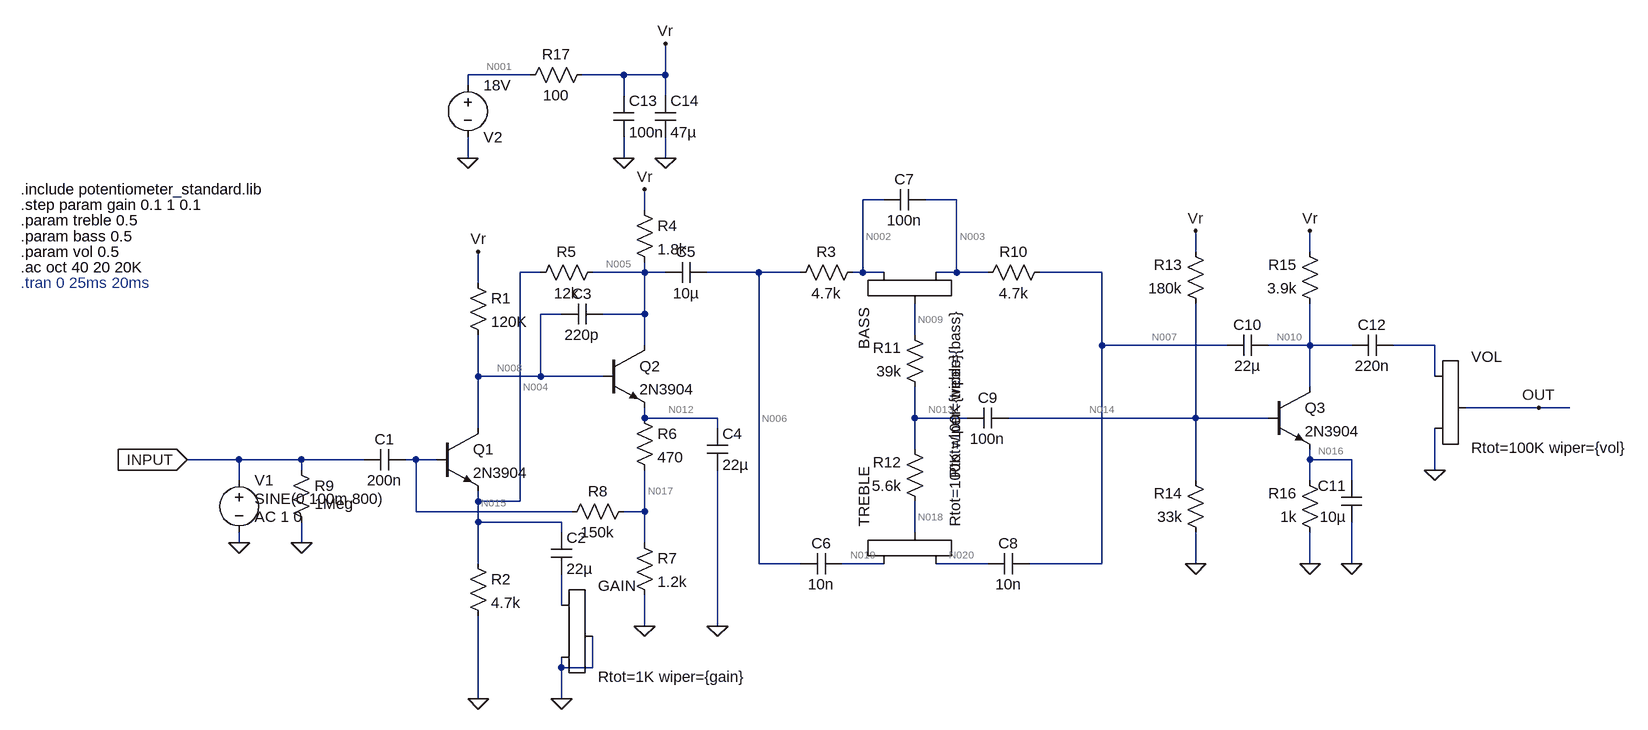
[diagram p0: schematic shining_pig.asc]
shining_pig.asc, the LTspice schematic file:
Version 4
SHEET 1 2004 680
WIRE 288 -400 192 -400
WIRE 432 -400 368 -400
WIRE 496 -400 496 -448
WIRE 496 -400 432 -400
WIRE 192 -384 192 -400
WIRE 432 -368 432 -400
WIRE 496 -368 496 -400
WIRE 192 -272 192 -304
WIRE 432 -272 432 -304
WIRE 496 -272 496 -304
WIRE 832 -208 800 -208
WIRE 944 -208 896 -208
WIRE 464 -192 464 -224
WIRE 1312 -128 1312 -160
WIRE 1488 -128 1488 -160
WIRE 304 -96 272 -96
WIRE 464 -96 464 -112
WIRE 464 -96 384 -96
WIRE 496 -96 464 -96
WIRE 640 -96 560 -96
WIRE 704 -96 640 -96
WIRE 800 -96 800 -208
WIRE 800 -96 784 -96
WIRE 832 -96 800 -96
WIRE 944 -96 944 -208
WIRE 944 -96 912 -96
WIRE 992 -96 944 -96
WIRE 1168 -96 1072 -96
WIRE 208 -80 208 -128
WIRE 336 -32 304 -32
WIRE 464 -32 464 -96
WIRE 464 -32 400 -32
WIRE 880 0 880 -48
WIRE 464 16 464 -32
WIRE 1168 16 1168 -96
WIRE 1360 16 1168 16
WIRE 1488 16 1488 -48
WIRE 1488 16 1424 16
WIRE 1552 16 1488 16
WIRE 1680 16 1616 16
WIRE 208 64 208 0
WIRE 304 64 304 -32
WIRE 304 64 208 64
WIRE 400 64 304 64
WIRE 1680 64 1680 16
WIRE 1488 80 1488 16
WIRE 1840 112 1728 112
WIRE 1888 112 1840 112
WIRE 464 128 464 112
WIRE 576 128 464 128
WIRE 880 128 880 80
WIRE 960 128 880 128
WIRE 1312 128 1312 -48
WIRE 1312 128 1024 128
WIRE 1424 128 1312 128
WIRE 208 144 208 64
WIRE 576 144 576 128
WIRE 880 176 880 128
WIRE -160 192 -240 192
WIRE -64 192 -160 192
WIRE 32 192 -64 192
WIRE 112 192 96 192
WIRE 144 192 112 192
WIRE 1488 192 1488 176
WIRE 1552 192 1488 192
WIRE -64 208 -64 192
WIRE 1680 208 1680 144
WIRE -160 224 -160 192
WIRE 1312 224 1312 128
WIRE 1488 224 1488 192
WIRE 1552 224 1552 192
WIRE 208 256 208 240
WIRE 272 256 272 -96
WIRE 272 256 208 256
WIRE 112 272 112 192
WIRE 352 272 112 272
WIRE 464 272 464 208
WIRE 464 272 432 272
WIRE 208 288 208 256
WIRE 336 288 208 288
WIRE 336 304 336 288
WIRE 880 304 880 256
WIRE -160 320 -160 304
WIRE -64 320 -64 288
WIRE 464 320 464 272
WIRE 208 352 208 288
WIRE 640 352 640 -96
WIRE 704 352 640 352
WIRE 832 352 768 352
WIRE 992 352 912 352
WIRE 1168 352 1168 16
WIRE 1168 352 1056 352
WIRE 1312 352 1312 304
WIRE 1488 352 1488 304
WIRE 1552 352 1552 288
WIRE 336 416 336 368
WIRE 464 448 464 400
WIRE 576 448 576 208
WIRE 336 512 336 496
WIRE 384 512 384 464
WIRE 384 512 336 512
WIRE 208 560 208 432
WIRE 336 560 336 512
FLAG -240 192 INPUT
IOPIN -240 192 In
FLAG -160 320 0
FLAG 208 560 0
FLAG 336 560 0
FLAG 464 448 0
FLAG 576 448 0
FLAG -64 320 0
FLAG 1312 352 0
FLAG 1488 352 0
FLAG 1552 352 0
FLAG 1680 208 0
FLAG 1840 112 OUT
FLAG 432 -272 0
FLAG 496 -272 0
FLAG 192 -272 0
FLAG 496 -448 Vr
FLAG 208 -128 Vr
FLAG 464 -224 Vr
FLAG 1312 -160 Vr
FLAG 1488 -160 Vr
SYMBOL cap 96 176 R90
WINDOW 0 0 32 VBottom 2
WINDOW 3 32 32 VTop 2
SYMATTR InstName C1
SYMATTR Value 200n
SYMBOL voltage -160 208 R0
WINDOW 3 24 44 Left 2
WINDOW 123 24 72 Left 2
WINDOW 39 0 0 Left 2
SYMATTR Value SINE(0 100m 800)
SYMATTR Value2 AC 1 0
SYMATTR InstName V1
SYMBOL npn 144 144 R0
SYMATTR InstName Q1
SYMATTR Value 2N3904
SYMBOL voltage 192 -400 R0
WINDOW 0 24 96 Left 2
WINDOW 3 24 16 Left 2
WINDOW 123 0 0 Left 2
WINDOW 39 0 0 Left 2
SYMATTR InstName V2
SYMATTR Value 18V
SYMBOL res 192 -96 R0
SYMATTR InstName R1
SYMATTR Value 120K
SYMATTR SpiceLine tol=1% pwr=0.25w
SYMBOL res 192 336 R0
SYMATTR InstName R2
SYMATTR Value 4.7k
SYMATTR SpiceLine tol=1% pwr=0.25W
SYMBOL cap 320 304 R0
SYMATTR InstName C2
SYMATTR Value 22µ
SYMBOL npn 400 16 R0
SYMATTR InstName Q2
SYMATTR Value 2N3904
SYMBOL res 448 -208 R0
SYMATTR InstName R4
SYMATTR Value 1.8k
SYMATTR SpiceLine tol=1% pwr=0.25w
SYMBOL res 400 -112 R90
WINDOW 0 0 56 VBottom 2
WINDOW 3 32 56 VTop 2
SYMATTR InstName R5
SYMATTR Value 12k
SYMATTR SpiceLine tol=1% pwr=0.25w
SYMBOL cap 400 -48 R90
WINDOW 0 0 32 VBottom 2
WINDOW 3 32 32 VTop 2
SYMATTR InstName C3
SYMATTR Value 220p
SYMBOL res 448 112 R0
SYMATTR InstName R6
SYMATTR Value 470
SYMATTR SpiceLine tol=1% pwr=0.25w
SYMBOL res 448 304 R0
SYMATTR InstName R7
SYMATTR Value 1.2k
SYMATTR SpiceLine tol=1% pwr=0.25w
SYMBOL res 448 256 R90
WINDOW 0 0 56 VBottom 2
WINDOW 3 32 56 VTop 2
SYMATTR InstName R8
SYMATTR Value 150k
SYMATTR SpiceLine tol=1% pwr=0.25w
SYMBOL cap 560 144 R0
SYMATTR InstName C4
SYMATTR Value 22µ
SYMBOL cap 560 -112 R90
WINDOW 0 0 32 VBottom 2
WINDOW 3 32 32 VTop 2
SYMATTR InstName C5
SYMATTR Value 10µ
SYMBOL res -80 192 R0
WINDOW 3 36 68 Left 2
SYMATTR Value 1Meg
SYMATTR InstName R9
SYMBOL potentiometer_standard 320 400 R0
WINDOW 39 48 69 Left 0
SYMATTR SpiceLine ""
SYMATTR InstName GAIN
SYMATTR Value Rtot=1K wiper={gain}
SYMBOL res 800 -112 R90
WINDOW 0 0 56 VBottom 2
WINDOW 3 32 56 VTop 2
SYMATTR InstName R3
SYMATTR Value 4.7k
SYMATTR SpiceLine tol=1% pwr=0.25w
SYMBOL cap 768 336 R90
WINDOW 0 0 32 VBottom 2
WINDOW 3 32 32 VTop 2
SYMATTR InstName C6
SYMATTR Value 10n
SYMBOL potentiometer_standard 816 368 R270
SYMATTR InstName TREBLE
SYMATTR Value Rtot=100K wiper={treble}
SYMATTR SpiceLine ""
SYMBOL potentiometer_standard 816 -112 M90
SYMATTR InstName BASS
SYMATTR Value Rtot=100K wiper={bass}
SYMATTR SpiceLine ""
SYMBOL res 1088 -112 R90
WINDOW 0 0 56 VBottom 2
WINDOW 3 32 56 VTop 2
SYMATTR InstName R10
SYMATTR Value 4.7k
SYMATTR SpiceLine tol=1% pwr=0.25w
SYMBOL cap 896 -224 R90
WINDOW 0 0 32 VBottom 2
WINDOW 3 32 32 VTop 2
SYMATTR InstName C7
SYMATTR Value 100n
SYMBOL cap 1056 336 R90
WINDOW 0 0 32 VBottom 2
WINDOW 3 32 32 VTop 2
SYMATTR InstName C8
SYMATTR Value 10n
SYMBOL res 896 96 R180
WINDOW 0 36 76 Left 2
WINDOW 3 36 40 Left 2
SYMATTR InstName R11
SYMATTR Value 39k
SYMATTR SpiceLine tol=1% pwr=0.25w
SYMBOL res 896 272 R180
WINDOW 0 36 76 Left 2
WINDOW 3 36 40 Left 2
SYMATTR InstName R12
SYMATTR Value 5.6k
SYMATTR SpiceLine tol=1% pwr=0.25w
SYMBOL cap 1024 112 R90
WINDOW 0 0 32 VBottom 2
WINDOW 3 32 32 VTop 2
SYMATTR InstName C9
SYMATTR Value 100n
SYMBOL res 1328 -32 R180
WINDOW 0 36 76 Left 2
WINDOW 3 36 40 Left 2
SYMATTR InstName R13
SYMATTR Value 180k
SYMATTR SpiceLine tol=1% pwr=0.25w
SYMBOL res 1328 320 R180
WINDOW 0 36 76 Left 2
WINDOW 3 36 40 Left 2
SYMATTR InstName R14
SYMATTR Value 33k
SYMATTR SpiceLine tol=1% pwr=0.25w
SYMBOL cap 1424 0 R90
WINDOW 0 0 32 VBottom 2
WINDOW 3 32 32 VTop 2
SYMATTR InstName C10
SYMATTR Value 22µ
SYMBOL res 1504 -32 R180
WINDOW 0 36 76 Left 2
WINDOW 3 36 40 Left 2
SYMATTR InstName R15
SYMATTR Value 3.9k
SYMATTR SpiceLine tol=1% pwr=0.25w
SYMBOL npn 1424 80 R0
SYMATTR InstName Q3
SYMATTR Value 2N3904
SYMBOL res 1504 320 R180
WINDOW 0 36 76 Left 2
WINDOW 3 36 40 Left 2
SYMATTR InstName R16
SYMATTR Value 1k
SYMATTR SpiceLine tol=1% pwr=0.25w
SYMBOL cap 1568 288 R180
WINDOW 0 24 56 Left 2
WINDOW 3 24 8 Left 2
SYMATTR InstName C11
SYMATTR Value 10µ
SYMBOL cap 1616 0 R90
WINDOW 0 0 32 VBottom 2
WINDOW 3 32 32 VTop 2
SYMATTR InstName C12
SYMATTR Value 220n
SYMBOL potentiometer_standard 1664 48 R0
SYMATTR InstName VOL
SYMATTR Value Rtot=100K wiper={vol}
SYMATTR SpiceLine ""
SYMBOL res 384 -416 R90
WINDOW 0 0 56 VBottom 2
WINDOW 3 32 56 VTop 2
SYMATTR InstName R17
SYMATTR Value 100
SYMBOL cap 416 -368 R0
SYMATTR InstName C13
SYMATTR Value 100n
SYMBOL cap 480 -368 R0
SYMATTR InstName C14
SYMATTR Value 47µ
TEXT -496 -80 Left 2 ;.tran 0 25ms 20ms
TEXT -496 -200 Left 2 !.step param gain 0.1 1 0.1
TEXT -496 -224 Left 2 !.include potentiometer_standard.lib
TEXT -496 -176 Left 2 !.param treble 0.5
TEXT -496 -152 Left 2 !.param bass 0.5
TEXT -496 -128 Left 2 !.param vol 0.5
TEXT -496 -104 Left 2 !.ac oct 40 20 20K

The netlist it stands for:
* shining_pig.asc
C1 N015 INPUT 200n
V1 INPUT 0 SINE(0 100m 800) AC 1 0
Q1 N008 N015 N004 0 2N3904
V2 N001 0 18V
R1 Vr N008 120K tol=1% pwr=0.25w
R2 N004 0 4.7k tol=1% pwr=0.25W
C2 N004 N021 22µ
Q2 N005 N008 N012 0 2N3904
R4 Vr N005 1.8k tol=1% pwr=0.25w
R5 N005 N004 12k tol=1% pwr=0.25w
C3 N005 N008 220p
R6 N012 N017 470 tol=1% pwr=0.25w
R7 N017 0 1.2k tol=1% pwr=0.25w
R8 N017 N015 150k tol=1% pwr=0.25w
C4 N012 0 22µ
C5 N006 N005 10µ
R9 INPUT 0 1Meg
XGAIN N021 0 0 Rtot=1K wiper={gain}
R3 N002 N006 4.7k tol=1% pwr=0.25w
C6 N019 N006 10n
XTREBLE N019 N020 N018 Rtot=100K wiper={treble}
XBASS N002 N003 N009 Rtot=100K wiper={bass}
R10 N007 N003 4.7k tol=1% pwr=0.25w
C7 N003 N002 100n
C8 N007 N020 10n
R11 N013 N009 39k tol=1% pwr=0.25w
R12 N018 N013 5.6k tol=1% pwr=0.25w
C9 N014 N013 100n
R13 N014 Vr 180k tol=1% pwr=0.25w
R14 0 N014 33k tol=1% pwr=0.25w
C10 N010 N007 22µ
R15 N010 Vr 3.9k tol=1% pwr=0.25w
Q3 N010 N014 N016 0 2N3904
R16 0 N016 1k tol=1% pwr=0.25w
C11 0 N016 10µ
C12 N011 N010 220n
XVOL N011 0 OUT Rtot=100K wiper={vol}
R17 Vr N001 100
C13 Vr 0 100n
C14 Vr 0 47µ
.model NPN NPN
.model PNP PNP
.lib standard.bjt
* .tran 0 25ms 20ms
.step param gain 0.1 1 0.1
.include potentiometer_standard.lib
.param treble 0.5
.param bass 0.5
.param vol 0.5
.ac oct 40 20 20K
.backanno
.end

* Results of the author's LTspice run, read from the files saved beside the schematic
* Operating Point (first step), zero values left out:
*   gain = 100 m
*   V(n015) = 3.837 V
*   V(n008) = 6.082 V
*   V(n004) = 3.246 V
*   V(n001) = 18 V
*   V(vr) = 17.41 V
*   V(n005) = 10.52 V
*   V(n012) = 5.397 V
*   V(n017) = 3.878 V
*   V(n006) = 328.9 µV
*   V(n002) = 328.9 µV
*   V(n019) = 328.9 µV
*   V(n018) = 328.9 µV
*   V(n020) = 328.9 µV
*   V(n009) = 328.9 µV
*   V(n003) = 328.9 µV
*   V(n007) = 328.9 µV
*   V(n013) = 328.9 µV
*   V(n014) = 2.536 V
*   V(n010) = 10.16 V
*   V(n016) = 1.867 V
*   Ic(Q3) = 1.861 mA
*   Ib(Q3) = 5.789 µA
*   Ie(Q3) = -1.867 mA
*   Ic(Q2) = 3.222 mA
*   Ib(Q2) = 10.36 µA
*   Ie(Q2) = -3.232 mA
*   Ic(Q1) = 84.06 µA
*   Ib(Q1) = 274.1 nA
*   Ie(Q1) = -84.34 µA
*   I(R17) = -5.866 mA
*   I(R16) = -1.867 mA
*   I(R15) = -1.861 mA
*   I(R14) = -76.86 µA
*   I(R13) = -82.65 µA
*   I(R8) = 274.1 nA
*   I(R7) = 3.232 mA
*   I(R6) = 3.232 mA
*   I(R5) = 606.4 µA
*   I(R4) = 3.828 mA
*   I(R2) = 690.7 µA
*   I(R1) = 94.42 µA
*   I(V2) = -5.866 mA